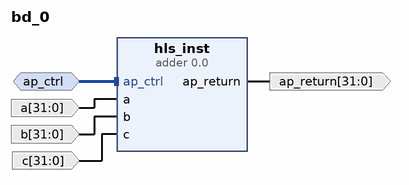
[diagram p0: block diagram of the top level]
# Vivado block design bd_0, xczu3eg-sbva484-1-i, Vivado 2019.1
create_bd_design bd_0

create_bd_intf_port -mode Slave -vlnv xilinx.com:interface:acc_handshake_rtl:1.0 ap_ctrl
create_bd_port -dir I -from 31 -to 0 -type data a
create_bd_port -dir O -from 31 -to 0 -type data ap_return
create_bd_port -dir I -from 31 -to 0 -type data b
create_bd_port -dir I -from 31 -to 0 -type data c

create_bd_cell -type ip -vlnv xilinx.com:hls:adder:0.0 hls_inst

# ---- connections ----

connect_bd_intf_net -intf_net ap_ctrl_0_1 [get_bd_intf_ports ap_ctrl] [get_bd_intf_pins hls_inst/ap_ctrl]
connect_bd_net -net a_0_1 [get_bd_ports a] [get_bd_pins hls_inst/a]
connect_bd_net [get_bd_pins hls_inst/ap_return] [get_bd_ports ap_return]
connect_bd_net -net b_0_1 [get_bd_ports b] [get_bd_pins hls_inst/b]
connect_bd_net -net c_0_1 [get_bd_ports c] [get_bd_pins hls_inst/c]

validate_bd_design
save_bd_design
